# Altium schematic sheet Sheet1.SchDoc
size A4; SheetNumber: 2; SheetTotal: 2
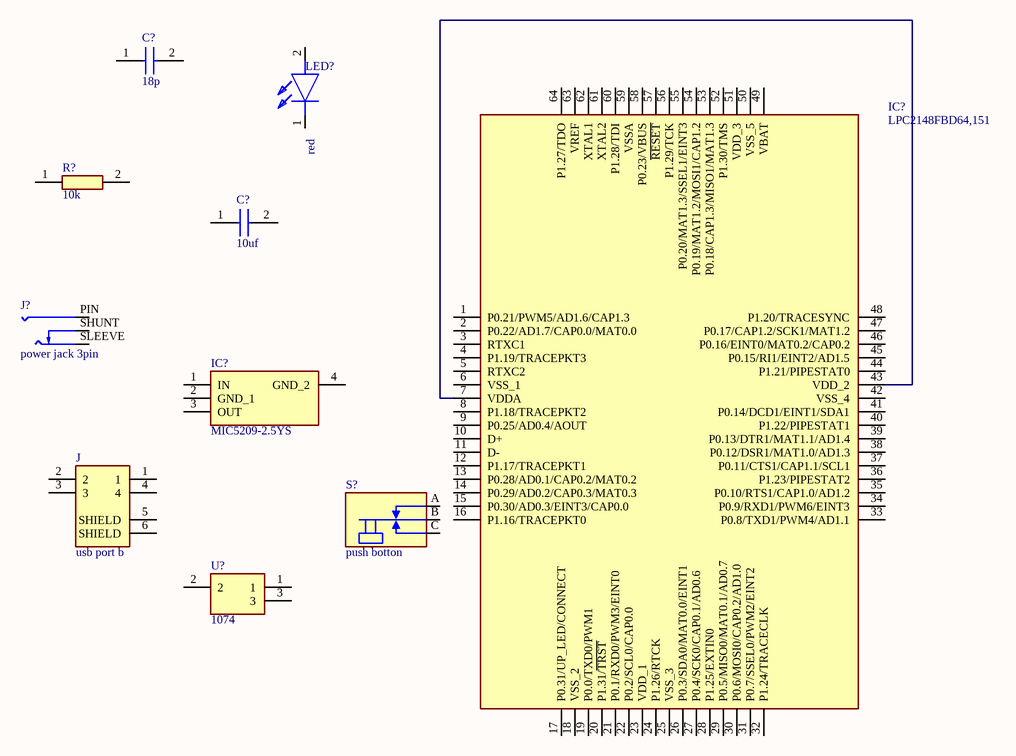
[diagram p0: Sheet1.SchDoc]

## Parts
(Parts that share a designator on the sheet are numbered #1, #2 ... from top to bottom, then left to right.)
C?#1  18p  [CAPC1005X56N]
C?#2  10uf  [CAPC1005X56N]
IC?#1  LPC2148FBD64,151  [QFP50P1200X1200X160-64N]
IC?#2  MIC5209-2.5YS  [SOT230P700X180-4N]
J  usb port b  [MOLEX_67068-8000]
J?  power jack 3pin  [SWITCHCRAFT_RAPC722BKZ]
LED?  red  [151051RS11000]
R?  10k  [RESC2012X65N]
S?  push botton  [SW_H203PCX]
U?  1074  [1074]

## Nets
NetIC?#1_7: IC?#1.7(VDDA) IC?#1.43(VDD_2)

Not connected (* = marked no-connect by the designer): C?#1 1 2; C?#2 1 2; IC?#1 1(P0.21/PWM5/AD1.6/CAP1.3) 2(P0.22/AD1.7/CAP0.0/MAT0.0) 3(RTXC1) 4(P1.19/TRACEPKT3) 5(RTXC2) 6(VSS_1) 8(P1.18/TRACEPKT2) 9(P0.25/AD0.4/AOUT) 10(D+) 11(D-) 12(P1.17/TRACEPKT1) 13(P0.28/AD0.1/CAP0.2/MAT0.2) 14(P0.29/AD0.2/CAP0.3/MAT0.3) 15(P0.30/AD0.3/EINT3/CAP0.0) 16(P1.16/TRACEPKT0) 17(P0.31/UP_LED/CONNECT) 18(VSS_2) 19(P0.0/TXD0/PWM1) 20(P1.31/~{TRST}) 21(P0.1/RXD0/PWM3/EINT0) 22(P0.2/SCL0/CAP0.0) 23(VDD_1) 24(P1.26/RTCK) 25(VSS_3) 26(P0.3/SDA0/MAT0.0/EINT1) 27(P0.4/SCK0/CAP0.1/AD0.6) 28(P1.25/EXTIN0) 29(P0.5/MISO0/MAT0.1/AD0.7) 30(P0.6/MOSI0/CAP0.2/AD1.0) 31(P0.7/SSEL0/PWM2/EINT2) 32(P1.24/TRACECLK) 33(P0.8/TXD1/PWM4/AD1.1) 34(P0.9/RXD1/PWM6/EINT3) 35(P0.10/RTS1/CAP1.0/AD1.2) 36(P1.23/PIPESTAT2) 37(P0.11/CTS1/CAP1.1/SCL1) 38(P0.12/DSR1/MAT1.0/AD1.3) 39(P0.13/DTR1/MAT1.1/AD1.4) 40(P1.22/PIPESTAT1) 41(P0.14/DCD1/EINT1/SDA1) 42(VSS_4) 44(P1.21/PIPESTAT0) 45(P0.15/RI1/EINT2/AD1.5) 46(P0.16/EINT0/MAT0.2/CAP0.2) 47(P0.17/CAP1.2/SCK1/MAT1.2) 48(P1.20/TRACESYNC) 49(VBAT) 50(VSS_5) 51(VDD_3) 52(P1.30/TMS) 53(P0.18/CAP1.3/MISO1/MAT1.3) 54(P0.19/MAT1.2/MOSI1/CAP1.2) 55(P0.20/MAT1.3/SSEL1/EINT3) 56(P1.29/TCK) 57(~{RESET}) 58(P0.23/VBUS) 59(VSSA) 60(P1.28/TDI) 61(XTAL2) 62(XTAL1) 63(VREF) 64(P1.27/TDO); IC?#2 1(IN) 2(GND_1) 3(OUT) 4(GND_2); J 1 2 3 4 5(SHIELD) 6(SHIELD); J? PIN SHUNT SLEEVE; LED? 1(K) 2(A); R? 1 2; S? A B C; U? 1 2 3

## Library data of the parts
C?#1 = 04023A180CAT2A: Capacitor; Manufacturer_Name: Kyocera AVX; Datasheet Link: http://www.mouser.com/catalog/supplier/library/pdf/AVXSurfaceMountCeramic.pdf; Height: 0.56mm; Manufacturer_Part_Number: 04023A180CAT2A; Mouser Part Number: 581-04023A180CAT2A; Mouser Price/Stock: https://www.mouser.com/Search/Refine.aspx?Keyword=581-04023A180CAT2A; Arrow Part Number: 04023A180CAT2A; Arrow Price/Stock: https://www.arrow.com/en/products/04023a180cat2a/avx
C?#2 = 04024D106MAT2A: Capacitor; Manufacturer_Name: Kyocera AVX; Datasheet Link: http://www.mouser.com/catalog/supplier/library/pdf/AVXSurfaceMountCeramic.pdf; Height: 0.56mm; Manufacturer_Part_Number: 04024D106MAT2A; Mouser Part Number: 581-04024D106MAT2A; Mouser Price/Stock: https://www.mouser.co.uk/ProductDetail/KYOCERA-AVX/04024D106MAT2A?qs=NBFAU1oqP4W0zKsr62mI7A%3D%3D
IC?#1 = LPC2148FBD64,151: Integrated Circuit; Manufacturer_Name: NXP; Datasheet Link: http://www.nxp.com/docs/en/data-sheet/LPC2141_42_44_46_48.pdf; Height: 1.6mm; Manufacturer_Part_Number: LPC2148FBD64,151; Mouser Part Number: 771-LPC2148FBD64-S; Mouser Price/Stock: https://www.mouser.co.uk/ProductDetail/NXP-Semiconductors/LPC2148FBD64151?qs=LOCUfHb8d9tLYNKsr9f%252BRg%3D%3D; Arrow Part Number: LPC2148FBD64,151; Arrow Price/Stock: https://www.arrow.com/en/products/lpc2148fbd64151/nxp-semiconductors
IC?#2 = MIC5209-2.5YS: Integrated Circuit; Manufacturer_Name: Microchip; Datasheet Link: https://componentsearchengine.com/Datasheets/2/MIC5209-2.5YS.pdf; Height: 1.8mm; Manufacturer_Part_Number: MIC5209-2.5YS; Mouser Part Number: 998-MIC5209-2.5YS; Mouser Price/Stock: https://www.mouser.co.uk/ProductDetail/Microchip-Technology/MIC5209-2.5YS?qs=kh6iOki%2FeLGfmmYc%252Bdo3Yw%3D%3D; Arrow Part Number: MIC5209-2.5YS; Arrow Price/Stock: https://www.arrow.com/en/products/mic5209-2.5ys/microchip-technology?region=nac
J = 67068-8000: USB-B _USB TYPE-B_ USB 2.0 Receptacle Connector 4 Position Through Hole, Right Angle; MF: Molex; MP: 67068-8000; Price: None; SnapEDA_Link: https://www.snapeda.com/parts/67068-8000/Molex/view-part/4703985/?ref=snap; Package: None; Availability: Unavailable; Value: *
J? = RAPC722BKZ: Power Barrel Connector Jack 2.50mm ID (0.098"), 5.50mm OD (0.217") Through Hole, Right Angle; Package: None; Price: None; Value: *; MP: RAPC722BKZ; Availability: Unavailable
LED? = 151051RS11000: LED; Manufacturer_Name: Wurth Elektronik; Datasheet Link: https://katalog.we-online.com/led/datasheet/151051RS11000.pdf; Height: 13.6mm; Manufacturer_Part_Number: 151051RS11000; Mouser Part Number: 710-151051RS11000; Mouser Price/Stock: https://www.mouser.co.uk/ProductDetail/Wurth-Elektronik/151051RS11000?qs=LlUlMxKIyB0NuMCRBgVmEg%3D%3D
R? = CPF0805B10K7E1: Resistor; Manufacturer_Name: TE Connectivity; Datasheet Link: http://docs-europe.electrocomponents.com/webdocs/13d1/0900766b813d116f.pdf; Height: 0.65mm; Manufacturer_Part_Number: CPF0805B10K7E1; Mouser Part Number: 279-CPF0805B10K7E1; Mouser Price/Stock: http://www.mouser.com/Search/ProductDetail.aspx?qs=5Dj%252bCDyFp7gFmIqrZdgsaQ%3d%3d
S? = H203PCX: Switch Push Button N.O./N.C. SPDT Round Button 0.25A 28VDC 30VA PC Pins Thru-Hole; MF: Switchcraft; SnapEDA_Link: https://www.snapeda.com/parts/H203PCX/Switchcraft+%252F+Conxall/view-part/?ref=snap; Package: None; Value: *; MP: H203PCX; Check_prices: https://www.snapeda.com/parts/H203PCX/Switchcraft+%252F+Conxall/view-part/?ref=eda
U? = 1074: Undefined or Miscellaneous; Manufacturer_Name: Keystone Electronics; Datasheet Link: https://www.keyelco.com/product-pdf.cfm?p=14390; Height: 18.3mm; Manufacturer_Part_Number: 1074; Mouser Part Number: 534-1074; Mouser Price/Stock: https://www.mouser.co.uk/ProductDetail/Keystone-Electronics/1074?qs=u16ybLDytRZ%2FZj7HSRmD5g%3D%3D